# Altium project SH_Project.PrjPcb
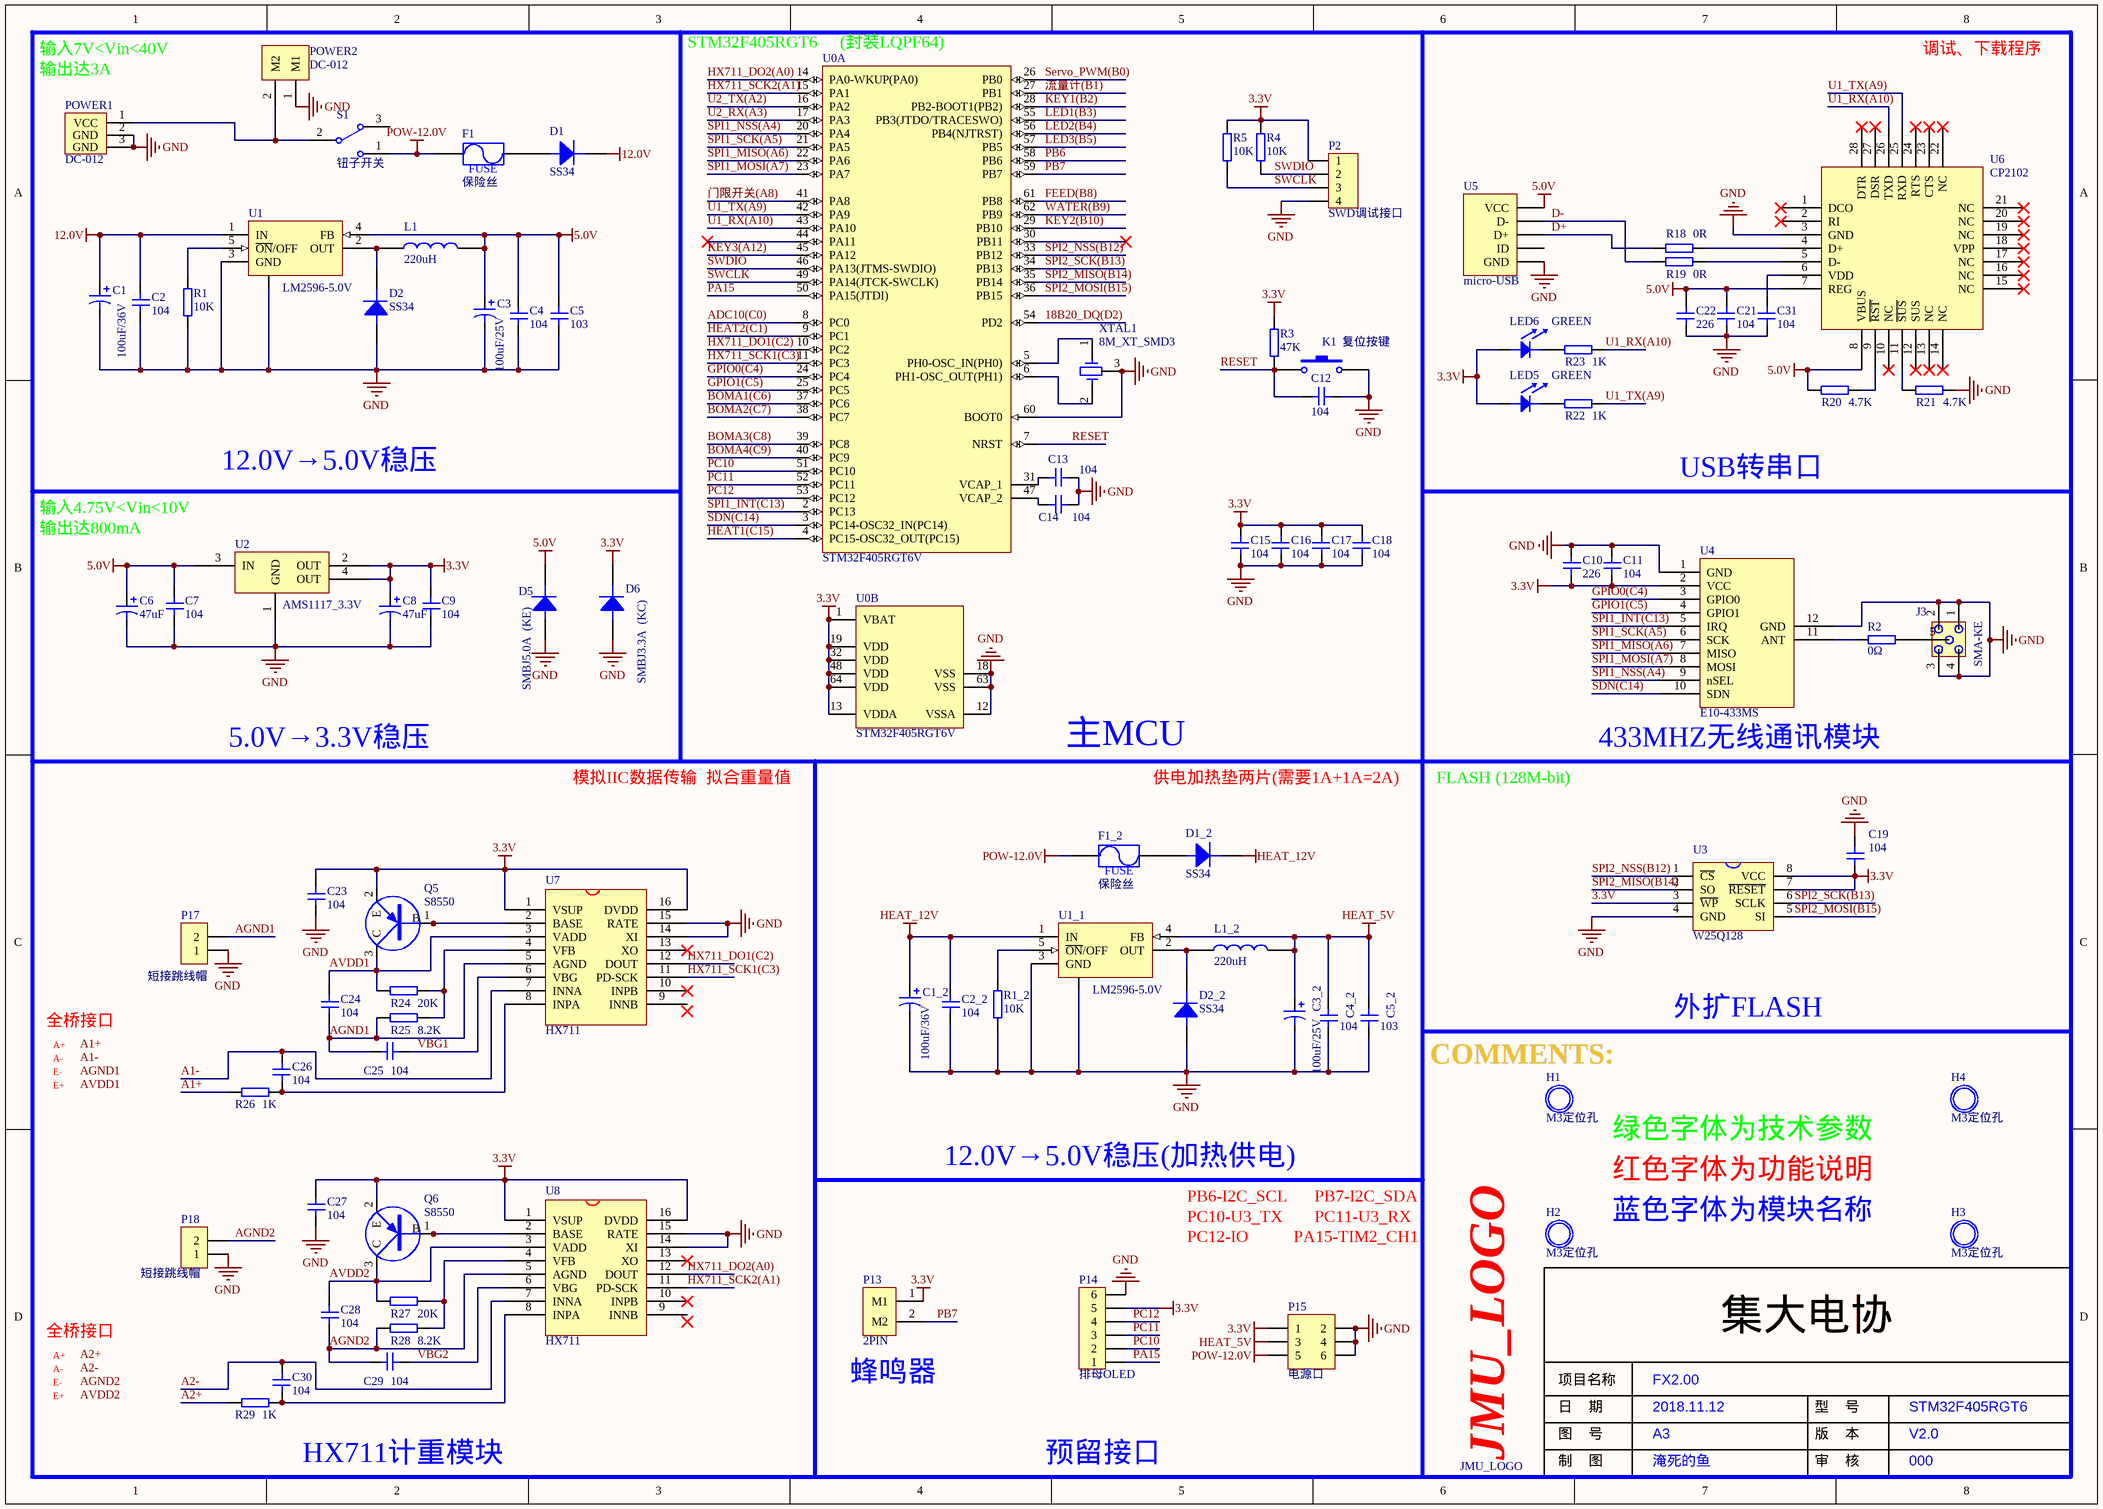
[diagram p0: FX_MCU.SchDoc]
2 sheets, 133 parts. Net scope: global (net labels, ports and power ports of the same name join across sheets).
Board file: FX_PCB.PcbDoc
Sheets:
  FX_MCU.SchDoc
  FX_Peripherals.SchDoc

## Sheet FX_MCU.SchDoc: FX2.00
size A3; Date: 2018.11.12; Engineer: 淹死的鱼; Address1: STM32F405RGT6; Address2: V2.0; Address3: 000; Address4: 4; DocumentNumber: A3; Application_BuildNumber: 5

### Parts
?  JMU_LOGO  [JMU_LOGO(1.35cm)]
C1  100uF/36V  [TAJ-D]
C1_2  100uF/36V  [TAJ-D]
C2  104  [0805C]
C2_2  104  [0805C]
C3  100uF/25V  [TAJ-D]
C3_2  100uF/25V  [TAJ-D]
C4  104  [0805C]
C4_2  104  [0805C]
C5  103  [0805C]
C5_2  103  [0805C]
C6  47uF  [TAJ-A]
C7  104  [0805C]
C8  47uF  [TAJ-A]
C9  104  [0805C]
C10  226  [0805C]
C11  104  [0805C]
C12  104  [0805C]
C13  104  [0805C]
C14  104  [0805C]
C15  104  [0805C]
C16  104  [0805C]
C17  104  [0805C]
C18  104  [0805C]
C19  104  [0805C]
C21  104  [0805C]
C22  226  [0805C]
C23  104  [0805C]
C24  104  [0805C]
C25  104  [0805C]
C26  104  [0805C]
C27  104  [0805C]
C28  104  [0805C]
C29  104  [0805C]
C30  104  [0805C]
C31  104  [0805C]
D1  SS34  [SMA/DO-214AC]
D1_2  SS34  [SMA/DO-214AC]
D2  SS34  [SMA/DO-214AC]
D2_2  SS34  [SMA/DO-214AC]
D5  SMBJ5.0A  (KE)  [SMBJ]
D6  SMBJ3.3A  (KC)  [SMBJ]
F1  保险丝  [1812]
F1_2  保险丝  [1812]
H1  M3定位孔  [定位孔]
H2  M3定位孔  [定位孔]
H3  M3定位孔  [定位孔]
H4  M3定位孔  [定位孔]
J3  SMA-KE  [SMA-KE]
K1  复位按键  [贴片按键]
L1  220uH  [电感 220uh]
L1_2  220uH  [电感 220uh]
LED5  GREEN  [0805LED]
LED6  GREEN  [0805LED]
P2  SWD调试接口  [Header 4]
P13  2PIN  [接线端子(2.54mm)-2PIN]
P14  排母OLED  [Header 6]
P15  电源口  [Header 3X2]
P17  短接跳线帽  [Header 2]
P18  短接跳线帽  [Header 2]
POWER1  DC-012  [DC-005]
POWER2  DC-012  [接线端子-2P-5.0MM]
Q5  S8550  [SOT-23]
Q6  S8550  [SOT-23]
R1  10K  [0805R]
R1_2  10K  [0805R]
R2  0Ω  [0805R]
R3  47K  [0805R]
R4  10K  [0805R]
R5  10K  [0805R]
R18  0R  [0805R]
R19  0R  [0805R]
R20  4.7K  [0805R]
R21  4.7K  [0805R]
R22  1K  [0805R]
R23  1K  [0805R]
R24  20K  [0805R]
R25  8.2K  [0805R]
R26  1K  [0805R]
R27  20K  [0805R]
R28  8.2K  [0805R]
R29  1K  [0805R]
S1  钮子开关  [钮子开关(大)]
U0  STM32F405RGT6V  [LQFP-64(GOOD)]  (parts A,B of 2)
U1  LM2596-5.0V  [TO-263-5 - duplicate]
U1_1  LM2596-5.0V  [TO-263-5 - duplicate]
U2  AMS1117_3.3V  [SOT-223]
U3  W25Q128  [SOW-8]
U4  E10-433MS  [E10-433MS]
U5  micro-USB  [Micro-USB (兼容牛角以及固定脚)]
U6  CP2102  [QFN-28]
U7  HX711  [SOP-16]
U8  HX711  [SOP-16]
XTAL1  8M_XT_SMD3  [三脚贴片8M晶振]

### Nets
3.3V: C8.1 C9.2 C10.1 C11.1 C15.1 C16.1 C17.1 C18.1 C19.1 C23.2 C27.2 D6.2 LED5.1 LED6.1 P2.1 P13.1(M1) P14.5 P15.1 Q5.2(E) Q6.2(E) R3.2 R4.1 R5.1 U0.1(VBAT) U0.13(VDDA) U0.19(VDD) U0.32(VDD) U0.48(VDD) U0.64(VDD) U2.2(OUT) U2.4(OUT) U3.3(~{WP}) U3.7(~{RESET}) U3.8(VCC) U4.2(VCC) U7.1(VSUP) U7.16(DVDD) U8.1(VSUP) U8.16(DVDD)
5.0V: C3.1 C4.2 C5.2 C6.1 C7.2 C21.1 C22.1 D5.2 L1.2 R20.1 U1.4(FB) U2.3(IN) U5.1(VCC) U6.7(REG) U6.8(VBUS)
12.0V: C1.1 C2.2 D1.2 U1.1(IN)
GND: C1.2 C1_2.2 C2.1 C2_2.1 C3.2 C3_2.2 C4.1 C4_2.1 C5.1 C5_2.1 C6.2 C7.1 C8.2 C9.1 C10.2 C11.2 C12.1 C13.1 C14.1 C15.2 C16.2 C17.2 C18.2 C19.2 C21.2 C22.2 C23.1 C27.1 C31.2 D2.1 D2_2.1 D5.1 D6.1 J3.1 J3.2 J3.3 J3.4 K1.2 P2.4 P14.6 P15.2 P15.4 P15.6 P17.1 P18.1 POWER1.2(GND) POWER1.3(GND) POWER2.1(M1) R1.1 R1_2.1 R21.2 U0.12(VSSA) U0.18(VSS) U0.60(BOOT0) U0.63(VSS) U1.3(GND) U1.6 U1_1.3(GND) U1_1.6 U2.1(GND) U3.4(GND) U4.1(GND) U4.12(GND) U5.5(GND) U6.3(GND) U7.14(XI) U7.15(RATE) U8.14(XI) U8.15(RATE) XTAL1.3
HEAT_5V: C3_2.1 C4_2.2 C5_2.2 L1_2.2 P15.3 U1_1.4(FB)
HEAT_12V: C1_2.1 C2_2.2 D1_2.2 U1_1.1(IN)
POW-12.0V: F1.1 F1_2.1 P15.5 S1.1
18B20_DQ(D2): U0.54(PD2)
A1+: R26.1
A1-: C26.1 U7.7(INNA)
A2+: R29.1
A2-: C30.1 U8.7(INNA)
ADC10(C0): U0.8(PC0)
AGND1: C24.1 C25.2 P17.2 R25.1 U7.5(AGND)
AGND2: C28.1 C29.2 P18.2 R28.1 U8.5(AGND)
AVDD1: C24.2 Q5.3(C) R24.1 U7.3(VADD)
AVDD2: C28.2 Q6.3(C) R27.1 U8.3(VADD)
BOMA1(C6): U0.37(PC6)
BOMA2(C7): U0.38(PC7)
BOMA3(C8): U0.39(PC8)
BOMA4(C9): U0.40(PC9)
D+: R18.1 U5.3(D+)
D-: R19.1 U5.2(D-)
FEED(B8): U0.61(PB8)
GPIO0(C4): U0.24(PC4) U4.3(GPIO0)
GPIO1(C5): U0.25(PC5) U4.4(GPIO1)
HEAT1(C15): U0.4(PC15-OSC32_OUT(PC15))
HEAT2(C1): U0.9(PC1)
HX711_DO1(C2): U0.10(PC2) U7.12(DOUT)
HX711_DO2(A0): U0.14(PA0-WKUP(PA0)) U8.12(DOUT)
HX711_SCK1(C3): U0.11(PC3) U7.11(PD-SCK)
HX711_SCK2(A1): U0.15(PA1) U8.11(PD-SCK)
KEY1(B2): U0.28(PB2-BOOT1(PB2))
KEY2(B10): U0.29(PB10)
KEY3(A12): U0.45(PA12)
LED1(B3): U0.55(PB3(JTDO/TRACESWO))
LED2(B4): U0.56(PB4(NJTRST))
LED3(B5): U0.57(PB5)
PA15: P14.1 U0.50(PA15(JTDI))
PB6: U0.58(PB6)
PB7: P13.2(M2) U0.59(PB7)
PC10: P14.2 U0.51(PC10)
PC11: P14.3 U0.52(PC11)
PC12: P14.4 U0.53(PC12)
RESET: C12.2 K1.1 R3.1 U0.7(NRST)
SDN(C14): U0.3(PC14-OSC32_IN(PC14)) U4.10(SDN)
Servo_PWM(B0): U0.26(PB0)
SPI1_INT(C13): U0.2(PC13) U4.5(IRQ)
SPI1_MISO(A6): U0.22(PA6) U4.7(MISO)
SPI1_MOSI(A7): U0.23(PA7) U4.8(MOSI)
SPI1_NSS(A4): U0.20(PA4) U4.9(nSEL)
SPI1_SCK(A5): U0.21(PA5) U4.6(SCK)
SPI2_MISO(B14): U0.35(PB14) U3.2(SO)
SPI2_MOSI(B15): U0.36(PB15) U3.5(SI)
SPI2_NSS(B12): U0.33(PB12) U3.1(~{CS})
SPI2_SCK(B13): U0.34(PB13) U3.6(SCLK)
SWCLK: P2.3 R5.2 U0.49(PA14(JTCK-SWCLK))
SWDIO: P2.2 R4.2 U0.46(PA13(JTMS-SWDIO))
U1_RX(A10): R23.2 U0.43(PA10) U6.26(TXD)
U1_TX(A9): R22.2 U0.42(PA9) U6.25(RXD)
U2_RX(A3): U0.17(PA3)
U2_TX(A2): U0.16(PA2)
VBG1: C25.1 U7.6(VBG)
VBG2: C29.1 U8.6(VBG)
WATER(B9): U0.62(PB9)
流量计(B1): U0.27(PB1)
门限开关(A8): U0.41(PA8)
NetC13_2: C13.2 U0.31(VCAP_1)
NetC14_2: C14.2 U0.47(VCAP_2)
NetC26_2: C26.2 R26.2 U7.8(INPA)
NetC30_2: C30.2 R29.2 U8.8(INPA)
NetC31_1: C31.1 U6.6(VDD)
NetD1_1: D1.1 F1.2
NetD1_2_1: D1_2.1 F1_2.2
NetD2_2: D2.2 L1.1 U1.2(OUT)
NetD2_2_2: D2_2.2 L1_2.1 U1_1.2(OUT)
NetJ3_5: J3.5 R2.2
NetLED5_2: LED5.2 R22.1
NetLED6_2: LED6.2 R23.1
NetPOWER1_1: POWER1.1(VCC) POWER2.2(M2) S1.2
NetQ5_1: Q5.1(B) U7.2(BASE)
NetQ6_1: Q6.1(B) U8.2(BASE)
NetR1_2: R1.2 U1.5(~{ON}/OFF)
NetR1_2_2: R1_2.2 U1_1.5(~{ON}/OFF)
NetR2_1: R2.1 U4.11(ANT)
NetR18_2: R18.2 U6.4(D+)
NetR19_2: R19.2 U6.5(D-)
NetR20_2: R20.2 U6.9(~{RST})
NetR21_1: R21.1 U6.11(~{SUS})
NetR24_2: R24.2 R25.2 U7.4(VFB)
NetR27_2: R27.2 R28.2 U8.4(VFB)
NetU0_5: U0.5(PH0-OSC_IN(PH0)) XTAL1.1
NetU0_6: U0.6(PH1-OSC_OUT(PH1)) XTAL1.2

Not connected (* = marked no-connect by the designer): S1 3; U0 30(PB11)* 44(PA11)*; U5 4(ID); U6 1(DCO)* 2(RI)* 10(NC)* 12(SUS)* 13(NC)* 14(NC)* 15(NC)* 16(NC)* 17(NC)* 18(VPP)* 19(NC)* 20(NC)* 21(NC)* 22(NC)* 23(CTS)* 24(RTS)* 27(DSR)* 28(DTR)*; U7 9(INNB) 10(INPB)* 13(XO)*; U8 9(INNB) 10(INPB)* 13(XO)*

### Notes on the sheet
- (near U0) STM32F405RGT6     (封装LQPF64)
- 输入7V<Vin<40V
- (near POWER1) 输出达3A
- 调试、下载程序
- 输入4.75V<Vin<10V
- 12.0V→5.0V稳压
- USB转串口
- 输出达800mA
- 5.0V→3.3V稳压
- 模拟IIC数据传输  拟合重量值
- 主MCU
- 供电加热垫两片(需要1A+1A=2A)
- FLASH (128M-bit)
- (near U4) 433MHZ无线通讯模块
- 全桥接口
- A+
- 外扩FLASH
- E-
- E+
- A-
- COMMENTS:
- 12.0V→5.0V稳压(加热供电)
- 绿色字体为技术参数
- 红色字体为功能说明
- PB6-I2C_SCL      PB7-I2C_SDA
- PC10-U3_TX       PC11-U3_RX
- PC12-IO          PA15-TIM2_CH1
- 蓝色字体为模块名称
- (near P13) 蜂鸣器
- HX711计重模块
- 预留接口
- Labels drawn without touching a wire or pin: A1+, A1-, A2+, A2-, AGND1, AGND2, AVDD1, AVDD2
- 集大电协
- 项目名称
- 日    期
- 图    号
- 版    本
- 型    号
- 制    图
- 审    核
- (in symbol Fuse) FUSE

### Library data of the parts
? = JMU_LOGO: LOGO
C1 C1_2 C3 C3_2 C6 C8 = Pol Cap: 极性贴片电容
C2 C2_2 C4 C4_2 C5 C5_2 C7 C9-C19 C21-C31 = Cap1: 无极贴片电容
D1 D1_2 D2 D2_2 D5 D6 = Diode: 二极管
F1 F1_2 = Fuse
K1 = 贴片按键: 轻触开关
L1 L1_2 = L: 电感
LED5 LED6 = LED: 发光二极管
P2 = Header 4: 排针
P13 = 接线端子-2PIN
P14 = Header 6: 排针
P15 = Header 3X2: 双排排针
P17 P18 = Header 2: 排针
POWER1 = DC-005: 电源插孔
POWER2 = 接线端子-2PIN: 2PIN
Q5 Q6 = S8550: PNP
R1 R1_2 R2-R5 R18-R29 = Res: 电阻
S1 = 钮子开关: 大功率开关
U0 = STM32F405RGT6V: ARM Cortex-M4 32-bit MCU+FPU, 210 DMIPS, 1024 kB Flash, 192 kB Internal RAM, 51 I/Os, 64-pin LQFP, -40 to 85 degC, Tray; Manufacturer: STMicroelectronics; D/A Converter: 2x12-bit; FLASH Size (Prog) (kB): 1024; I/Os (High Current): 51; Internal RAM Size (kB): 192; Operating Frequency(F) (Processor speed) (MHz): 168; Supply Voltage(Vcc) max (V): 3.6; Supply Voltage(Vcc) min (V): 1.8; DatasheetVersion: Rev. 4; PackageVersion: Rev. 4, 06/2013; PackageReference: LQFP64; PackageDescription: 64-Pin Low Profile Quad Flat Package, 10 x 10 mm Body, 0.5 mm Pitch; Supplier 1: Digi-Key; Supplier Part Number 1: STM32F405RGT6V-ND; Supplier 2: Farnell; Supplier Part Number 2: 2333282; Supplier 3: Newark; Supplier Part Number 3: 99W9900; Supplier 4: Newark; Supplier Part Number 4: 66W7297; Supplier 5: Mouser; Supplier Part Number 5: 511-STM32F405RGT6V; Core: ARM Cortex-M4; Packing: Tray; Mounting Technology: Surface Mount; PartNumber: STM32F405RGT6V; ComponentLink1Description: Manufacturer URL; ComponentLink1URL: http://www.st.com/web/en/home.html; ComponentLink2Description: Datasheet; ComponentLink2URL: http://www.st.com/st-web-ui/static/active/en/resource/technical/document/datasheet/DM00037051.pdf; ComponentLink3Description: Package Specification; ComponentLink3URL: http://www.st.com/st-web-ui/static/active/en/resource/technical/document/datasheet/DM00037051.pdf
U1 U1_1 = LM2596: 5V电源芯片
U2 = AMS1117-3.3V/5.0V: 电源芯片
U5 = micro-USB: USB接口
U6 = CP2102: USB转串口芯片
U7 U8 = HX711: A/D转换器芯片
XTAL1 = XTAL三脚贴片晶振

## Sheet FX_Peripherals.SchDoc: FX2.00
size A4; Date: 2018.11.13; Author: 淹死的鱼; Engineer: 淹死的鱼; Address2: V2.00; DocumentNumber: A4
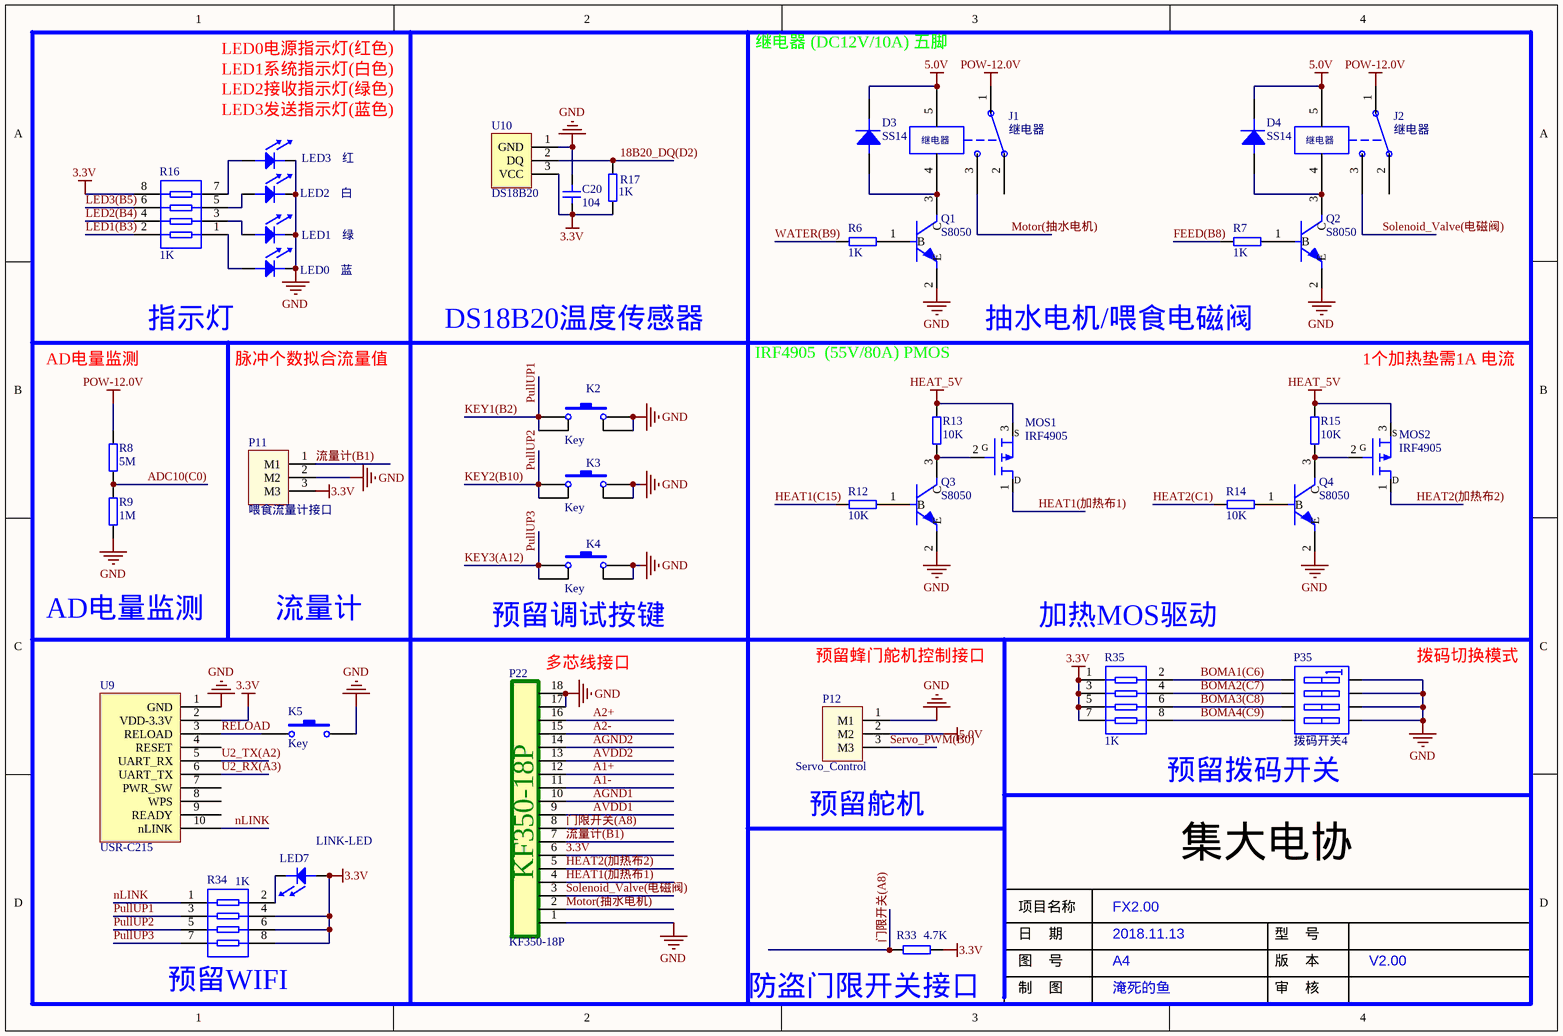
[diagram p1: FX_Peripherals.SchDoc]

### Parts
C20  104  [0805C]
D3  SS14  [SMA/DO-214AC]
D4  SS14  [SMA/DO-214AC]
J1  继电器  [继电器(小型)]
J2  继电器  [继电器(小型)]
K2  Key  [SW_PB4_DIP]
K3  Key  [SW_PB4_DIP]
K4  Key  [SW_PB4_DIP]
K5  Key  [贴片按键]
LED0  蓝  [0805LED]
LED1  绿  [0805LED]
LED2  白  [0805LED]
LED3  红  [0805LED]
LED7  LINK-LED  [0805LED]
MOS1  IRF4905  [IRF4905(PMOS)]
MOS2  IRF4905  [IRF4905(PMOS)]
P11  喂食流量计接口  [接线端子(2.54mm)-3PIN]
P12  Servo_Control  [接线端子(2.54mm)-3PIN]
P22  KF350-18P  [KF350-18P]
P35  拨码开关4  [拨码开关(4位直插)]
Q1  S8050  [SOT-23]
Q2  S8050  [SOT-23]
Q3  S8050  [SOT-23]
Q4  S8050  [SOT-23]
R6  1K  [0805R]
R7  1K  [0805R]
R8  5M  [0805R]
R9  1M  [0805R]
R12  10K  [0805R]
R13  10K  [0805R]
R14  10K  [0805R]
R15  10K  [0805R]
R16  1K  [排阻(4位贴片)]
R17  1K  [0805R]
R33  4.7K  [0805R]
R34  1K  [排阻(4位贴片)]
R35  1K  [排阻(4位贴片)]
U9  USR-C215  [USR-C215]
U10  DS18B20  [TO-92]

### Nets
3.3V: C20.2 LED7.1 P11.3(M3) P22.6 R16.8 R17.1 R33.2 R34.4 R34.6 R34.8 R35.1 R35.3 R35.5 R35.7 U9.2(VDD-3.3V) U10.3(VCC)
5.0V: D3.2 D4.2 J1.5 J2.5 P12.2(M2)
GND: C20.1 K2.2 K2.3 K3.2 K3.3 K4.2 K4.3 K5.2 LED0.2 LED1.2 LED2.2 LED3.2 P11.2(M2) P12.1(M1) P22.1 P22.17 P22.18 P35.5(B4) P35.6(B3) P35.7(B2) P35.8(B1) Q1.2(E) Q2.2(E) Q3.2(E) Q4.2(E) R9.2 U9.1(GND) U10.1(GND)
HEAT_5V: MOS1.3(S) MOS2.3(S) R13.1 R15.1
POW-12.0V: J1.1 J2.1 R8.1
18B20_DQ(D2): R17.2 U10.2(DQ)
A1+: P22.12
A1-: P22.11
A2+: P22.16
A2-: P22.15
ADC10(C0): R8.2 R9.1
AGND1: P22.10
AGND2: P22.14
AVDD1: P22.9
AVDD2: P22.13
BOMA1(C6): P35.1(A1) R35.2
BOMA2(C7): P35.2(A2) R35.4
BOMA3(C8): P35.3(A3) R35.6
BOMA4(C9): P35.4(A4) R35.8
FEED(B8): R7.2
HEAT1(C15): R12.2
HEAT1(加热布1): MOS1.1(D) P22.4
HEAT2(C1): R14.2
HEAT2(加热布2): MOS2.1(D) P22.5
KEY1(B2): K2.1 K2.4 R34.3  [also labelled PullUP1]
KEY2(B10): K3.1 K3.4 R34.5  [also labelled PullUP2]
KEY3(A12): K4.1 K4.4 R34.7  [also labelled PullUP3]
LED1(B3): R16.2
LED2(B4): R16.4
LED3(B5): R16.6
Motor(抽水电机): J1.3 P22.2
nLINK: R34.1 U9.10(nLINK)
RELOAD: K5.1 U9.3(RELOAD)
Servo_PWM(B0): P12.3(M3)
Solenoid_Valve(电磁阀): J2.3 P22.3
U2_RX(A3): U9.6(UART_TX)
U2_TX(A2): U9.5(UART_RX)
WATER(B9): R6.2
流量计(B1): P11.1(M1) P22.7
门限开关(A8): P22.8 R33.1
NetD3_1: D3.1 J1.4 Q1.3(C)
NetD4_1: D4.1 J2.4 Q2.3(C)
NetLED0_1: LED0.1 R16.1
NetLED1_1: LED1.1 R16.3
NetLED2_1: LED2.1 R16.5
NetLED3_1: LED3.1 R16.7
NetLED7_2: LED7.2 R34.2
NetMOS1_2: MOS1.2(G) Q3.3(C) R13.2
NetMOS2_2: MOS2.2(G) Q4.3(C) R15.2
NetQ1_1: Q1.1(B) R6.1
NetQ2_1: Q2.1(B) R7.1
NetQ3_1: Q3.1(B) R12.1
NetQ4_1: Q4.1(B) R14.1

Not connected (* = marked no-connect by the designer): J1 2; J2 2; U9 4(RESET) 7(PWR_SW) 8(WPS) 9(READY)

### Notes on the sheet
- LED1系统指示灯(白色)
- LED2接收指示灯(绿色)
- (near LED3) LED3发送指示灯(蓝色)
- LED0电源指示灯(红色)
- 继电器 (DC12V/10A) 五脚
- AD电量监测
- 指示灯
- 脉冲个数拟合流量值
- DS18B20温度传感器
- IRF4905  (55V/80A) PMOS
- 抽水电机/喂食电磁阀
- 1个加热垫需1A 电流
- 流量计
- (near K4) 预留调试按键
- (near R35) 加热MOS驱动
- (near P22) 多芯线接口
- 预留蜂门舵机控制接口
- 拨码切换模式
- 预留拨码开关
- (near P12) 预留舵机
- (near R34) 预留WIFI
- (near R33) 防盗门限开关接口
- 集大电协
- 项目名称
- 日    期
- 图    号
- 版    本
- 型    号
- 制    图
- 审    核

### Library data of the parts
C20 = Cap1: 无极贴片电容
D3 D4 = Diode: 二极管
K2-K4 = 轻触开关: 四脚按键
K5 = 贴片按键: 轻触开关
LED0-LED3 LED7 = LED: 发光二极管
MOS1 MOS2 = PMOS
P11 P12 = 接线端子-3PIN: 3PIN
P22 = 接线端子KF350-18P
P35 = 拨码开关4: 4位拨码开关
Q1-Q4 = NPN: NPN三极管
R6-R9 R12-R15 R17 R33 = Res: 电阻
R16 R34 R35 = Res-4: 排阻
U9 = USR-C215: WIFI模块
U10 = DS18B20: 数字温度传感器

## Nets that join several sheets
3.3V: FX_MCU (39 pins), FX_Peripherals (16 pins)
5.0V: FX_MCU (15 pins), FX_Peripherals (5 pins)
GND: FX_MCU (70 pins), FX_Peripherals (28 pins)
HEAT_5V: FX_MCU (6 pins), FX_Peripherals (MOS1.3 MOS2.3 R13.1 R15.1)
POW-12.0V: FX_MCU (F1.1 F1_2.1 P15.5 S1.1), FX_Peripherals (J1.1 J2.1 R8.1)
18B20_DQ(D2): FX_MCU (U0.54), FX_Peripherals (R17.2 U10.2)
A1+: FX_MCU (R26.1), FX_Peripherals (P22.12)
A1-: FX_MCU (C26.1 U7.7), FX_Peripherals (P22.11)
A2+: FX_MCU (R29.1), FX_Peripherals (P22.16)
A2-: FX_MCU (C30.1 U8.7), FX_Peripherals (P22.15)
ADC10(C0): FX_MCU (U0.8), FX_Peripherals (R8.2 R9.1)
AGND1: FX_MCU (5 pins), FX_Peripherals (P22.10)
AGND2: FX_MCU (5 pins), FX_Peripherals (P22.14)
AVDD1: FX_MCU (C24.2 Q5.3 R24.1 U7.3), FX_Peripherals (P22.9)
AVDD2: FX_MCU (C28.2 Q6.3 R27.1 U8.3), FX_Peripherals (P22.13)
BOMA1(C6): FX_MCU (U0.37), FX_Peripherals (P35.1 R35.2)
BOMA2(C7): FX_MCU (U0.38), FX_Peripherals (P35.2 R35.4)
BOMA3(C8): FX_MCU (U0.39), FX_Peripherals (P35.3 R35.6)
BOMA4(C9): FX_MCU (U0.40), FX_Peripherals (P35.4 R35.8)
FEED(B8): FX_MCU (U0.61), FX_Peripherals (R7.2)
HEAT1(C15): FX_MCU (U0.4), FX_Peripherals (R12.2)
HEAT2(C1): FX_MCU (U0.9), FX_Peripherals (R14.2)
KEY1(B2): FX_MCU (U0.28), FX_Peripherals (K2.1 K2.4 R34.3)
KEY2(B10): FX_MCU (U0.29), FX_Peripherals (K3.1 K3.4 R34.5)
KEY3(A12): FX_MCU (U0.45), FX_Peripherals (K4.1 K4.4 R34.7)
LED1(B3): FX_MCU (U0.55), FX_Peripherals (R16.2)
LED2(B4): FX_MCU (U0.56), FX_Peripherals (R16.4)
LED3(B5): FX_MCU (U0.57), FX_Peripherals (R16.6)
Servo_PWM(B0): FX_MCU (U0.26), FX_Peripherals (P12.3)
U2_RX(A3): FX_MCU (U0.17), FX_Peripherals (U9.6)
U2_TX(A2): FX_MCU (U0.16), FX_Peripherals (U9.5)
WATER(B9): FX_MCU (U0.62), FX_Peripherals (R6.2)
流量计(B1): FX_MCU (U0.27), FX_Peripherals (P11.1 P22.7)
门限开关(A8): FX_MCU (U0.41), FX_Peripherals (P22.8 R33.1)